# Altium schematic sheet Cap 100uF.schdoc
size 124 x 101 mm
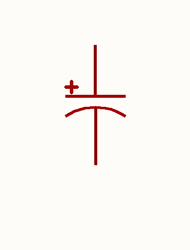
[diagram p0: Cap 100uF.schdoc]

## Parts
C?  100uF  [CAP-SMD_BD8.0-L8.3-W8.3-LS9.5-FD]  (value not drawn)

## Nets

Not connected (* = marked no-connect by the designer): C? 1 2

## Library data of the parts
C? = EEEHC1E101P: Manufacturer: PANASONIC(松下); Add into BOM: yes; Tolerance: ±20%; Ripple Current: 130mA@120Hz; Lifetime @ Temp: 5000hrs@105℃; Symbol: EEEHC1E101P; Device: EEEHC1E101P; LCSC Part Name: 100uF ±20% 25V; Supplier Part: C336335; Manufacturer Part: EEEHC1E101P; Supplier Footprint: SMD,D8xL10.2mm; JLCPCB Part Class: Extended Part; Datasheet: https://atta.szlcsc.com/upload/public/pdf/source/20190305/C336336_78C21C8ECF10E68AF1E1A1FAA303815A.pdf; Supplier: LCSC; Convert to PCB: yes; Value: 100uF; Equivalent Series Resistance(ESR): -; Operating Temperature: -40℃~+105℃